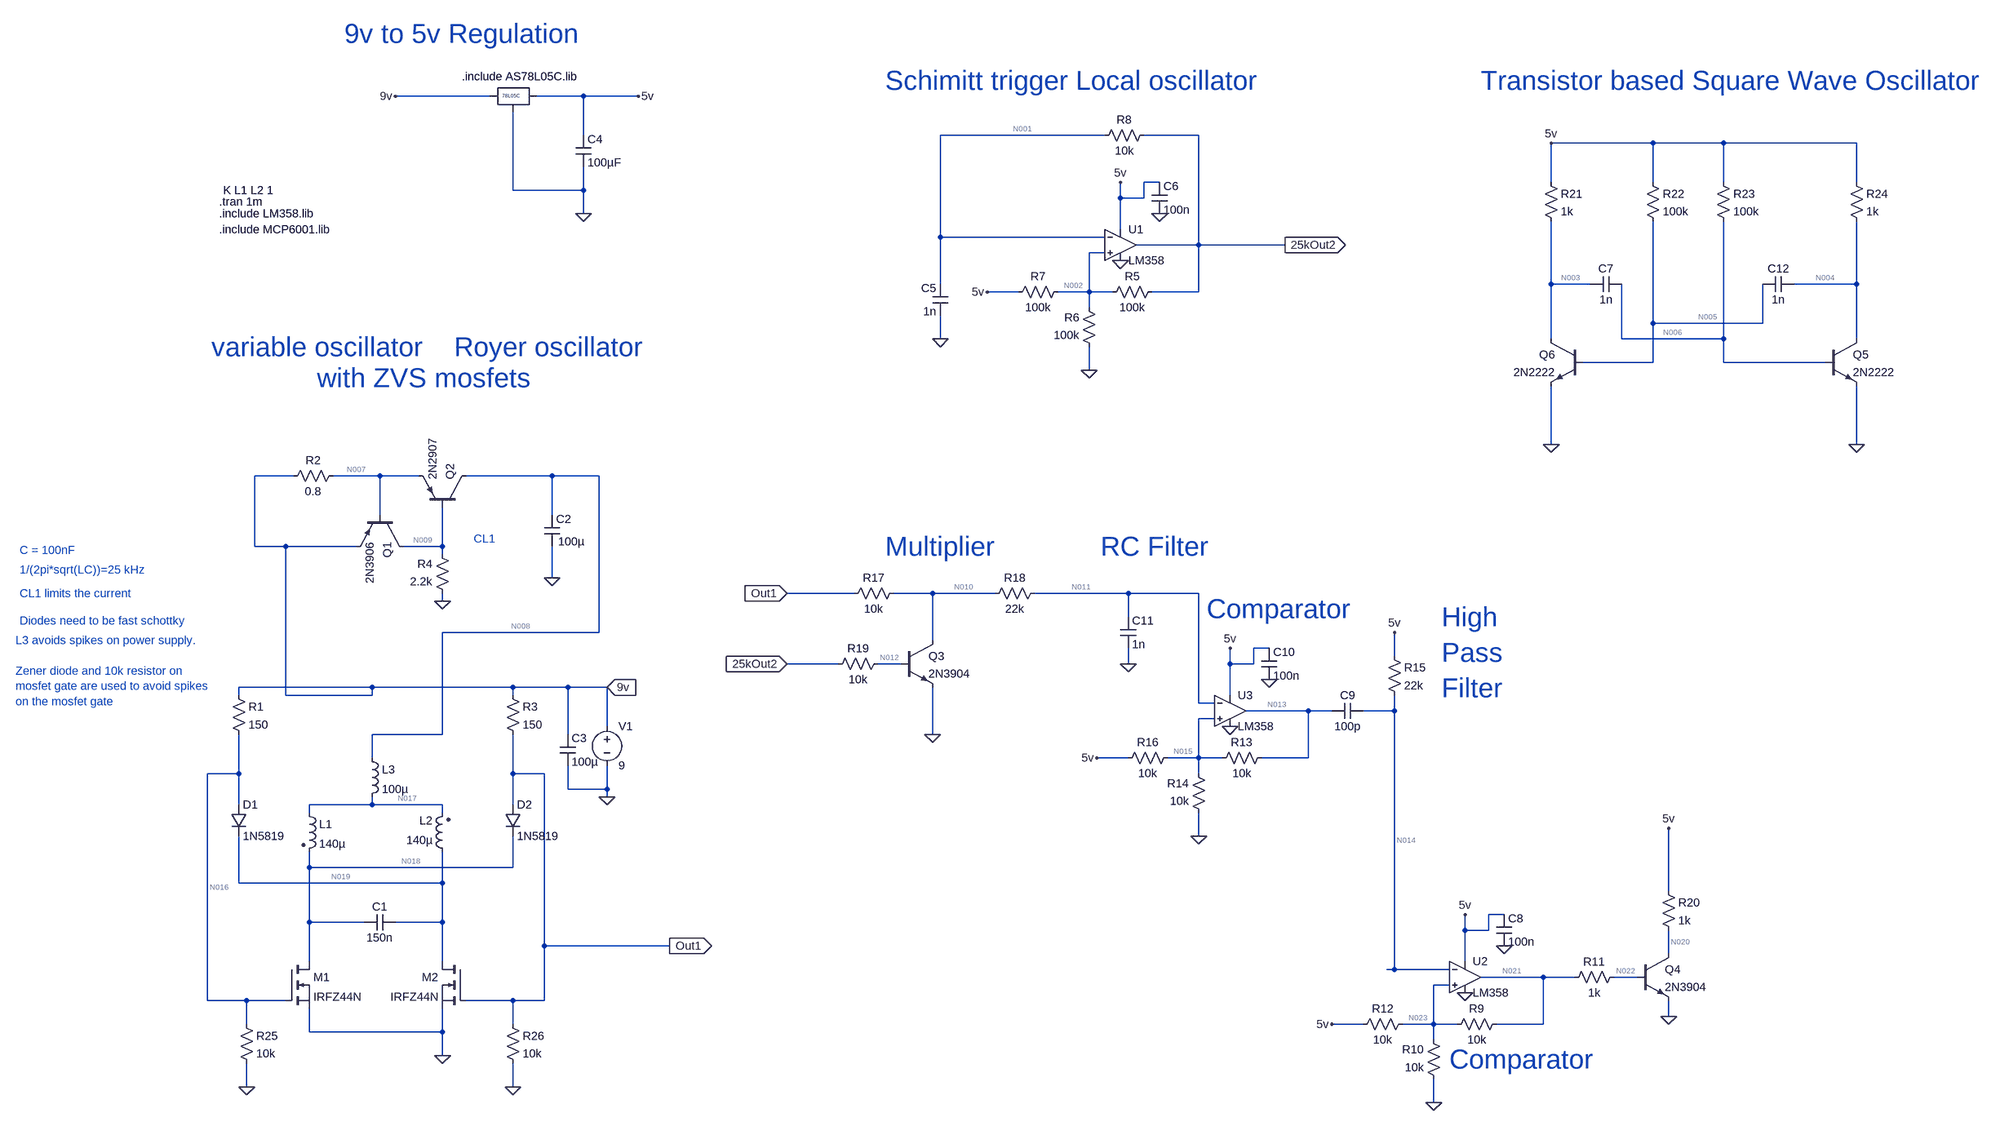
[diagram p0: schematic Model 1.asc]
Model 1.asc, the LTspice schematic file:
Version 4.1
SHEET 1 3832 1860
WIRE 560 -784 368 -784
WIRE 752 -784 656 -784
WIRE 864 -784 752 -784
WIRE 752 -704 752 -784
WIRE 1872 -704 1536 -704
WIRE 2064 -704 1952 -704
WIRE 2992 -688 2784 -688
WIRE 3136 -688 2992 -688
WIRE 3408 -688 3136 -688
WIRE 1984 -608 1952 -608
WIRE 2784 -608 2784 -688
WIRE 2992 -608 2992 -688
WIRE 3136 -608 3136 -688
WIRE 3408 -608 3408 -688
WIRE 608 -592 608 -752
WIRE 752 -592 752 -640
WIRE 752 -592 608 -592
WIRE 1904 -576 1904 -608
WIRE 1952 -576 1952 -608
WIRE 1952 -576 1904 -576
WIRE 752 -544 752 -592
WIRE 1904 -512 1904 -576
WIRE 1536 -496 1536 -704
WIRE 1872 -496 1536 -496
WIRE 2064 -480 2064 -704
WIRE 2064 -480 1936 -480
WIRE 2240 -480 2064 -480
WIRE 1872 -464 1840 -464
WIRE 1536 -400 1536 -496
WIRE 2784 -400 2784 -528
WIRE 2864 -400 2784 -400
WIRE 3408 -400 3408 -528
WIRE 3408 -400 3280 -400
WIRE 1696 -384 1632 -384
WIRE 1840 -384 1840 -464
WIRE 1840 -384 1776 -384
WIRE 1888 -384 1840 -384
WIRE 2064 -384 2064 -480
WIRE 2064 -384 1968 -384
WIRE 1840 -352 1840 -384
WIRE 2992 -320 2992 -528
WIRE 3216 -320 3216 -400
WIRE 3216 -320 2992 -320
WIRE 1536 -288 1536 -336
WIRE 2784 -288 2784 -400
WIRE 2928 -288 2928 -400
WIRE 3136 -288 3136 -528
WIRE 3136 -288 2928 -288
WIRE 3408 -288 3408 -400
WIRE 2992 -240 2992 -320
WIRE 2992 -240 2848 -240
WIRE 3136 -240 3136 -288
WIRE 3344 -240 3136 -240
WIRE 1840 -224 1840 -272
WIRE 2784 -64 2784 -192
WIRE 3408 -64 3408 -192
WIRE 160 0 80 0
WIRE 336 0 240 0
WIRE 416 0 336 0
WIRE 688 0 512 0
WIRE 784 0 688 0
WIRE 336 80 336 0
WIRE 688 80 688 0
WIRE 80 144 80 0
WIRE 144 144 80 144
WIRE 288 144 144 144
WIRE 464 144 464 64
WIRE 464 144 384 144
WIRE 464 160 464 144
WIRE 688 208 688 144
WIRE 1360 240 1168 240
WIRE 1520 240 1440 240
WIRE 1648 240 1520 240
WIRE 1920 240 1728 240
WIRE 2064 240 1920 240
WIRE 464 256 464 240
WIRE 1920 288 1920 240
WIRE 784 320 784 0
WIRE 784 320 464 320
WIRE 1520 336 1520 240
WIRE 2208 352 2176 352
WIRE 2464 368 2464 320
WIRE 1328 384 1168 384
WIRE 1456 384 1408 384
WIRE 1920 384 1920 352
WIRE 2128 384 2128 352
WIRE 2176 384 2176 352
WIRE 2176 384 2128 384
WIRE 320 432 48 432
WIRE 608 432 320 432
WIRE 720 432 608 432
WIRE 800 432 720 432
WIRE 48 448 48 432
WIRE 144 448 144 144
WIRE 320 448 320 432
WIRE 320 448 144 448
WIRE 608 448 608 432
WIRE 2128 448 2128 384
WIRE 2064 464 2064 240
WIRE 2096 464 2064 464
WIRE 2288 480 2160 480
WIRE 2336 480 2288 480
WIRE 2464 480 2464 448
WIRE 2464 480 2400 480
WIRE 2096 496 2064 496
WIRE 800 512 800 432
WIRE 464 528 464 320
WIRE 464 528 320 528
WIRE 720 528 720 432
WIRE 1520 528 1520 432
WIRE 320 576 320 528
WIRE 1920 576 1856 576
WIRE 2064 576 2064 496
WIRE 2064 576 2000 576
WIRE 2112 576 2064 576
WIRE 2288 576 2288 480
WIRE 2288 576 2192 576
WIRE 48 608 48 528
WIRE 48 608 -16 608
WIRE 608 608 608 528
WIRE 672 608 608 608
WIRE 2064 608 2064 576
WIRE 720 640 720 592
WIRE 800 640 800 592
WIRE 800 640 720 640
WIRE 800 656 800 640
WIRE 48 672 48 608
WIRE 320 672 320 656
WIRE 320 672 192 672
WIRE 464 672 320 672
WIRE 608 672 608 608
WIRE 192 688 192 672
WIRE 464 688 464 672
WIRE 2064 736 2064 688
WIRE 192 800 192 768
WIRE 608 800 608 736
WIRE 608 800 192 800
WIRE 48 832 48 736
WIRE 464 832 464 768
WIRE 464 832 48 832
WIRE 3024 848 3024 720
WIRE 2688 896 2656 896
WIRE 192 912 192 800
WIRE 304 912 192 912
WIRE 464 912 464 832
WIRE 464 912 368 912
WIRE 2608 928 2608 896
WIRE 2656 928 2656 896
WIRE 2656 928 2608 928
WIRE 672 960 672 608
WIRE 928 960 672 960
WIRE 3024 976 3024 928
WIRE 192 992 192 912
WIRE 464 992 464 912
WIRE 2608 992 2608 928
WIRE 2464 1008 2464 480
WIRE 2464 1008 2448 1008
WIRE 2576 1008 2464 1008
WIRE 2768 1024 2640 1024
WIRE 2832 1024 2768 1024
WIRE 2960 1024 2912 1024
WIRE 2576 1040 2544 1040
WIRE -16 1072 -16 608
WIRE 64 1072 -16 1072
WIRE 144 1072 64 1072
WIRE 608 1072 512 1072
WIRE 672 1072 672 960
WIRE 672 1072 608 1072
WIRE 3024 1104 3024 1072
WIRE 64 1120 64 1072
WIRE 608 1120 608 1072
WIRE 2400 1120 2336 1120
WIRE 2544 1120 2544 1040
WIRE 2544 1120 2480 1120
WIRE 2592 1120 2544 1120
WIRE 2768 1120 2768 1024
WIRE 2768 1120 2672 1120
WIRE 192 1136 192 1088
WIRE 464 1136 464 1088
WIRE 464 1136 192 1136
WIRE 2544 1152 2544 1120
WIRE 464 1184 464 1136
WIRE 64 1248 64 1200
WIRE 608 1248 608 1200
WIRE 2544 1280 2544 1232
FLAG 464 1184 0
FLAG 800 656 0
FLAG 464 256 0
FLAG 688 208 0
FLAG 928 960 Out1
IOPIN 928 960 Out
FLAG 800 432 9v
IOPIN 800 432 In
FLAG 752 -544 0
FLAG 368 -784 9v
FLAG 864 -784 5v
FLAG 1840 -224 0
FLAG 1536 -288 0
FLAG 1904 -448 0
FLAG 1984 -544 0
FLAG 2240 -480 25kOut2
IOPIN 2240 -480 Out
FLAG 1904 -608 5v
FLAG 1632 -384 5v
FLAG 2544 1280 0
FLAG 2608 1056 0
FLAG 2688 960 0
FLAG 2608 896 5v
FLAG 2336 1120 5v
FLAG 2064 736 0
FLAG 2128 512 0
FLAG 2208 416 0
FLAG 2128 352 5v
FLAG 1856 576 5v
FLAG 1520 528 0
FLAG 1920 384 0
FLAG 2464 320 5v
FLAG 1168 240 Out1
IOPIN 1168 240 In
FLAG 1168 384 25kOut2
IOPIN 1168 384 In
FLAG 3024 1104 0
FLAG 3024 720 5v
FLAG 2784 -64 0
FLAG 3408 -64 0
FLAG 2784 -688 5v
FLAG 64 1248 0
FLAG 608 1248 0
SYMBOL res 32 432 R0
SYMATTR InstName R1
SYMATTR Value 150
SYMBOL res 592 432 R0
SYMATTR InstName R3
SYMATTR Value 150
SYMBOL ind2 176 672 R0
SYMATTR InstName L1
SYMATTR Value 140µ
SYMATTR Type ind
SYMBOL ind2 480 784 R180
WINDOW 0 36 80 Left 2
WINDOW 3 36 40 Left 2
SYMATTR InstName L2
SYMATTR Value 140µ
SYMATTR Type ind
SYMBOL ind 304 560 R0
SYMATTR InstName L3
SYMATTR Value 100µ
SYMBOL cap 368 896 R90
WINDOW 0 0 32 VBottom 2
WINDOW 3 32 32 VTop 2
SYMATTR InstName C1
SYMATTR Value 150n
SYMBOL diode 32 672 R0
SYMATTR InstName D1
SYMATTR Value 1N5819
SYMBOL diode 592 672 R0
SYMATTR InstName D2
SYMATTR Value 1N5819
SYMBOL nmos 144 992 R0
SYMATTR InstName M1
SYMATTR Value IRFZ44N
SYMBOL nmos 512 992 M0
SYMATTR InstName M2
SYMATTR Value IRFZ44N
SYMBOL voltage 800 496 R0
WINDOW 123 0 0 Left 0
WINDOW 39 0 0 Left 0
SYMATTR InstName V1
SYMATTR Value 9
SYMBOL pnp 384 80 R90
SYMATTR InstName Q1
SYMATTR Value 2N3906
SYMBOL pnp 512 64 M270
SYMATTR InstName Q2
SYMATTR Value 2N2907
SYMBOL res 256 -16 R90
WINDOW 0 0 56 VBottom 2
WINDOW 3 32 56 VTop 2
SYMATTR InstName R2
SYMATTR Value 0.8
SYMBOL res 480 256 R180
WINDOW 0 36 76 Left 2
WINDOW 3 36 40 Left 2
SYMATTR InstName R4
SYMATTR Value 2.2k
SYMBOL cap 672 80 R0
WINDOW 3 28 54 Left 2
SYMATTR Value 100µ
SYMATTR InstName C2
SYMBOL cap 704 528 R0
SYMATTR InstName C3
SYMATTR Value 100µ
SYMBOL 78L05C 608 -784 R0
WINDOW 0 -22 0 Left 0
SYMATTR InstName 78L05C
SYMBOL cap 736 -704 R0
SYMATTR InstName C4
SYMATTR Value 100µF
SYMBOL res 1984 -400 R90
WINDOW 0 0 56 VBottom 2
WINDOW 3 32 56 VTop 2
SYMATTR InstName R5
SYMATTR Value 100k
SYMBOL res 1856 -256 R180
WINDOW 0 36 76 Left 2
WINDOW 3 36 40 Left 2
SYMATTR InstName R6
SYMATTR Value 100k
SYMBOL res 1968 -720 R90
WINDOW 0 0 56 VBottom 2
WINDOW 3 32 56 VTop 2
SYMATTR InstName R8
SYMATTR Value 10k
SYMBOL cap 1552 -336 R180
WINDOW 0 24 56 Left 2
WINDOW 3 24 8 Left 2
SYMATTR InstName C5
SYMATTR Value 1n
SYMBOL res 1792 -400 R90
WINDOW 0 0 56 VBottom 2
WINDOW 3 32 56 VTop 2
SYMATTR InstName R7
SYMATTR Value 100k
SYMBOL cap 1968 -608 R0
SYMATTR InstName C6
SYMATTR Value 100n
SYMBOL OpAmps\\opamp2 2608 960 R0
SYMATTR InstName U2
SYMATTR Value LM358
SYMBOL res 2688 1104 R90
WINDOW 0 0 56 VBottom 2
WINDOW 3 32 56 VTop 2
SYMATTR InstName R9
SYMATTR Value 10k
SYMBOL res 2560 1248 R180
WINDOW 0 36 76 Left 2
WINDOW 3 36 40 Left 2
SYMATTR InstName R10
SYMATTR Value 10k
SYMBOL res 2496 1104 R90
WINDOW 0 0 56 VBottom 2
WINDOW 3 32 56 VTop 2
SYMATTR InstName R12
SYMATTR Value 10k
SYMBOL cap 2672 896 R0
SYMATTR InstName C8
SYMATTR Value 100n
SYMBOL OpAmps\\opamp2 2128 416 R0
SYMATTR InstName U3
SYMATTR Value LM358
SYMBOL res 2208 560 R90
WINDOW 0 0 56 VBottom 2
WINDOW 3 32 56 VTop 2
SYMATTR InstName R13
SYMATTR Value 10k
SYMBOL res 2080 704 R180
WINDOW 0 36 76 Left 2
WINDOW 3 36 40 Left 2
SYMATTR InstName R14
SYMATTR Value 10k
SYMBOL res 2016 560 R90
WINDOW 0 0 56 VBottom 2
WINDOW 3 32 56 VTop 2
SYMATTR InstName R16
SYMATTR Value 10k
SYMBOL cap 2192 352 R0
SYMATTR InstName C10
SYMATTR Value 100n
SYMBOL npn 1456 336 R0
SYMATTR InstName Q3
SYMATTR Value 2N3904
SYMBOL res 1456 224 R90
WINDOW 0 0 56 VBottom 2
WINDOW 3 32 56 VTop 2
SYMATTR InstName R17
SYMATTR Value 10k
SYMBOL res 1744 224 R90
WINDOW 0 0 56 VBottom 2
WINDOW 3 32 56 VTop 2
SYMATTR InstName R18
SYMATTR Value 22k
SYMBOL cap 1904 288 R0
SYMATTR InstName C11
SYMATTR Value 1n
SYMBOL res 1424 368 R90
WINDOW 0 0 56 VBottom 2
WINDOW 3 32 56 VTop 2
SYMATTR InstName R19
SYMATTR Value 10k
SYMBOL cap 2400 464 R90
WINDOW 0 0 32 VBottom 2
WINDOW 3 32 32 VTop 2
SYMATTR InstName C9
SYMATTR Value 100p
SYMBOL res 2448 352 R0
SYMATTR InstName R15
SYMATTR Value 22k
SYMBOL res 2928 1008 R90
WINDOW 0 0 56 VBottom 2
WINDOW 3 32 56 VTop 2
SYMATTR InstName R11
SYMATTR Value 1k
SYMBOL npn 2960 976 R0
SYMATTR InstName Q4
SYMATTR Value 2N3904
SYMBOL res 3008 832 R0
SYMATTR InstName R20
SYMATTR Value 1k
SYMBOL npn 3344 -288 R0
SYMATTR InstName Q5
SYMATTR Value 2N2222
SYMBOL npn 2848 -288 M0
SYMATTR InstName Q6
SYMATTR Value 2N2222
SYMBOL cap 2928 -416 R90
WINDOW 0 0 32 VBottom 2
WINDOW 3 32 32 VTop 2
SYMATTR InstName C7
SYMATTR Value 1n
SYMBOL cap 3280 -416 R90
WINDOW 0 0 32 VBottom 2
WINDOW 3 32 32 VTop 2
SYMATTR InstName C12
SYMATTR Value 1n
SYMBOL res 2768 -624 R0
SYMATTR InstName R21
SYMATTR Value 1k
SYMBOL res 2976 -624 R0
SYMATTR InstName R22
SYMATTR Value 100k
SYMBOL res 3120 -624 R0
SYMATTR InstName R23
SYMATTR Value 100k
SYMBOL res 3392 -624 R0
SYMATTR InstName R24
SYMATTR Value 1k
SYMBOL OpAmps\\opamp2 1904 -544 R0
SYMATTR InstName U1
SYMATTR Value LM358
SYMBOL res 48 1104 R0
SYMATTR InstName R25
SYMATTR Value 10k
SYMBOL res 592 1104 R0
SYMATTR InstName R26
SYMATTR Value 10k
TEXT 8 -568 Left 2 !.tran 1m
TEXT 16 -592 Left 2 !K L1 L2 1
TEXT -400 152 Left 2 ;C = 100nF
TEXT -400 192 Left 2 ;1/(2pi*sqrt(LC))=25 kHz
TEXT -400 240 Left 2 ;CL1 limits the current
TEXT 488 -272 Left 5 ;Royer oscillator
TEXT -400 296 Left 2 ;Diodes need to be fast schottky
TEXT -408 336 Left 2 ;L3 avoids spikes on power supply.\n \nZener diode and 10k resistor on \nmosfet gate are used to avoid spikes\non the mosfet gate
TEXT 528 128 Left 2 ;CL1
TEXT 264 -912 Left 5 ;9v to 5v Regulation
TEXT 504 -824 Left 2 !.include AS78L05C.lib
TEXT -8 -272 Left 5 ;variable oscillator
TEXT 1424 -816 Left 5 ;Schimitt trigger Local oscillator
TEXT 8 -544 Left 2 !.include LM358.lib
TEXT 1424 144 Left 5 ;Multiplier
TEXT 1864 144 Left 5 ;RC Filter
TEXT 2080 272 Left 5 ;Comparator
TEXT 2560 288 Left 5 ;High \nPass \nFilter
TEXT 2576 1192 Left 5 ;Comparator
TEXT 208 -208 Left 5 ;with ZVS mosfets
TEXT 2640 -816 Left 5 ;Transistor based Square Wave Oscillator
TEXT 8 -512 Left 2 !.include MCP6001.lib

The netlist it stands for:
* Model 1.asc
R1 9v N016 150
R3 9v Out1 150
L1 N017 N018 140µ
L2 N019 N017 140µ
L3 N008 N017 100µ
C1 N019 N018 150n
D1 N016 N019 1N5819
D2 Out1 N018 1N5819
M1 N018 N016 0 0 IRFZ44N
M2 N019 Out1 0 0 IRFZ44N
V1 9v 0 9
Q1 N009 N007 9v 0 2N3906
Q2 N008 N009 N007 0 2N2907
R2 N007 9v 0.8
R4 0 N009 2.2k
C2 N008 0 100µ
C3 9v 0 100µ
X§78L05C 9v 0 5v AS78L05C  ; pins IN GND OUT
C4 5v 0 100µF
R5 25kOut2 N002 100k
R6 0 N002 100k
R8 25kOut2 N001 10k
C5 0 N001 1n
R7 N002 5v 100k
C6 5v 0 100n
X§U2 N023 N014 5v 0 N021 LM358  ; pins In+ In- V+ V- OUT
R9 N021 N023 10k
R10 0 N023 10k
R12 N023 5v 10k
C8 5v 0 100n
X§U3 N015 N011 5v 0 N013 LM358  ; pins In+ In- V+ V- OUT
R13 N013 N015 10k
R14 0 N015 10k
R16 N015 5v 10k
C10 5v 0 100n
Q3 N010 N012 0 0 2N3904
R17 N010 Out1 10k
R18 N011 N010 22k
C11 N011 0 1n
R19 N012 25kOut2 10k
C9 N014 N013 100p
R15 5v N014 22k
R11 N022 N021 1k
Q4 N020 N022 0 0 2N3904
R20 5v N020 1k
Q5 N004 N006 0 0 2N2222
Q6 N003 N005 0 0 2N2222
C7 N006 N003 1n
C12 N004 N005 1n
R21 5v N003 1k
R22 5v N005 100k
R23 5v N006 100k
R24 5v N004 1k
X§U1 N002 N001 5v 0 25kOut2 LM358  ; pins In+ In- V+ V- OUT
R25 N016 0 10k
R26 Out1 0 10k
.model D D
.lib standard.dio
.model NPN NPN
.model PNP PNP
.lib standard.bjt
.model NMOS NMOS
.model PMOS PMOS
.lib standard.mos
.tran 1m
K L1 L2 1
* C = 100nF
* 1/(2pi*sqrt(LC))=25 kHz
* CL1 limits the current
* Royer oscillator
* Diodes need to be fast schottky
* L3 avoids spikes on power supply.
* Zener diode and 10k resistor on
* mosfet gate are used to avoid spikes
* on the mosfet gate
* CL1
* 9v to 5v Regulation
.include AS78L05C.lib
* variable oscillator
* Schimitt trigger Local oscillator
.include LM358.lib
* Multiplier
* RC Filter
* Comparator
* High
* Pass
* Filter
* Comparator
* with ZVS mosfets
* Transistor based Square Wave Oscillator
.include MCP6001.lib
.backanno
.end

* Results of the author's LTspice run, read from the files saved beside the schematic
* Operating Point, zero values left out:
*   V(n016) = 4.132 V
*   V(n017) = 3.885 V
*   V(n018) = 3.885 V
*   V(n008) = 3.885 V
*   V(5v) = 5 V
*   V(n002) = 2.503 V
*   V(n001) = 2.505 V
*   V(n014) = 4.929 V
*   V(n011) = 81.63 mV
*   V(n010) = 15.81 mV
*   V(n020) = 5 V
*   V(n006) = 698.5 mV
*   V(n003) = 120.3 mV
*   V(9v) = 9 V
*   V(out1) = 4.132 V
*   V(n019) = 3.885 V
*   V(n009) = 7.734 V
*   V(n007) = 8.68 V
*   V(25kout2) = 2.505 V
*   V(n023) = 1.691 V
*   V(n021) = 39.54 mV
*   V(n015) = 2.989 V
*   V(n013) = 3.995 V
*   V(n012) = 666 mV
*   V(n022) = 39.54 mV
*   V(n004) = 120.3 mV
*   V(n005) = 698.5 mV
*   I(R2) = -400.5 mA
*   I(R10) = -169.1 µA
*   I(R11) = 4.923 pA
*   I(R1) = 32.45 mA
*   I(R24) = 4.88 mA
*   I(R25) = 413.2 µA
*   I(R13) = 100.6 µA
*   I(V1) = -465.4 mA
*   I(R19) = -183.9 µA
*   I(L1) = 199.3 mA
*   I(R5) = 16.2 nA
*   I(R20) = 5.001 pA
*   I(R21) = 4.88 mA
*   I(D2) = 31.63 mA
*   I(R17) = -411.6 µA
*   I(R15) = 3.243 µA
*   Ic(Q2) = -397 mA
*   Ib(Q2) = -3.515 mA
*   Ie(Q2) = 400.5 mA
*   I(R9) = -165.1 µA
*   Ic(Q6) = 4.88 mA
*   Ib(Q6) = 43.02 µA
*   Ie(Q6) = -4.923 mA
*   I(R16) = -201.1 µA
*   I(L3) = 397 mA
*   I(R23) = 43.02 µA
*   I(R3) = 32.45 mA
*   I(R8) = -37.96 nA
*   Id(M2) = 229.8 mA
*   Is(M2) = -229.8 mA
*   I(R4) = -3.515 mA
*   I(R12) = -330.9 µA
*   Ic(Q3) = 414.6 µA
*   Ib(Q3) = 183.9 µA
*   Ie(Q3) = -598.5 µA
*   I(D1) = 32.04 mA
*   Ic(Q4) = 5.009 pA
*   Ib(Q4) = -4.923 pA
*   Ic(Q1) = -2.423 nA
*   Ib(Q1) = -11.37 pA
*   Ie(Q1) = 2.435 nA
*   I(R26) = 413.2 µA
*   I(L2) = -197.7 mA
*   I(R14) = -298.9 µA
*   I(R7) = -24.97 µA
*   Ic(Q5) = 4.88 mA
*   Ib(Q5) = 43.02 µA
*   Ie(Q5) = -4.923 mA
*   Id(M1) = 230.9 mA
*   Is(M1) = -230.9 mA
*   I(R18) = 2.992 µA
*   I(R6) = -25.03 µA
*   I(R22) = 43.02 µA
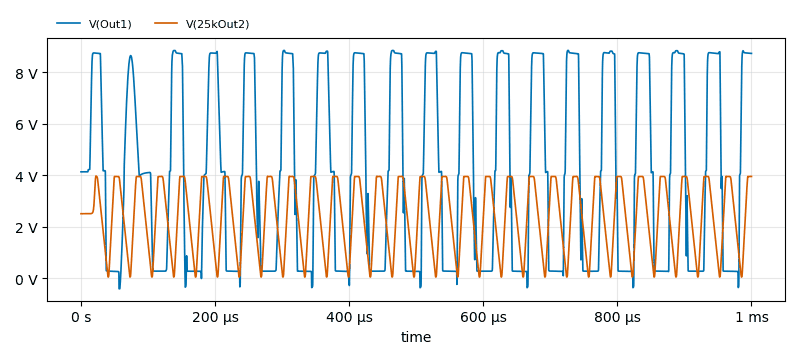
[diagram p1: Transient Analysis of Model 1.asc, plotted from the saved traces]
* Transient Analysis, 1 run:
*   V(Out1): min -412.3 mV, max 8.851 V, average 3.979 V, rms 5.434 V, last 8.732 V
*   V(25kOut2): min 43.8 mV, max 3.969 V, average 2.377 V, rms 2.722 V, last 3.952 V